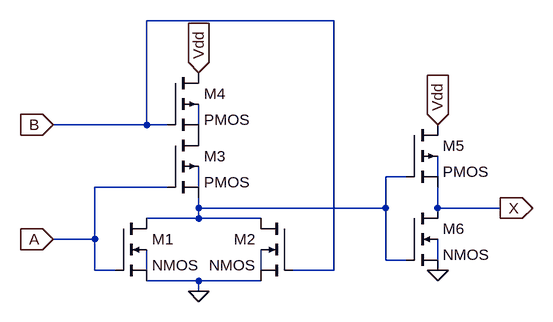
[diagram p0: schematic or_gate.asc]
or_gate.asc, the LTspice schematic file:
Version 4.1
SHEET 1 880 680
WIRE 400 -16 112 -16
WIRE 112 144 112 -16
WIRE 112 144 -32 144
WIRE 144 144 112 144
WIRE 192 144 192 112
WIRE 512 224 480 224
WIRE 560 224 560 192
WIRE 144 240 32 240
WIRE 192 240 192 208
WIRE 192 272 192 256
WIRE 480 272 480 224
WIRE 480 272 192 272
WIRE 560 272 560 240
WIRE 656 272 560 272
WIRE 192 288 192 272
WIRE 192 288 112 288
WIRE 288 288 192 288
WIRE 32 320 32 240
WIRE 32 320 -32 320
WIRE 480 352 480 272
WIRE 512 352 480 352
WIRE 560 352 560 320
WIRE 32 368 32 320
WIRE 64 368 32 368
WIRE 112 368 112 336
WIRE 288 368 288 336
WIRE 400 368 400 -16
WIRE 400 368 336 368
WIRE 192 384 112 384
WIRE 288 384 192 384
WIRE 192 400 192 384
FLAG 192 400 0
FLAG 192 64 Vdd
IOPIN 192 64 In
FLAG -32 320 A
IOPIN -32 320 In
FLAG -32 144 B
IOPIN -32 144 In
FLAG 656 272 X
IOPIN 656 272 Out
FLAG 560 368 0
FLAG 560 144 Vdd
IOPIN 560 144 In
SYMBOL nmos4 64 288 R0
SYMATTR InstName M1
SYMBOL nmos4 336 288 M0
SYMATTR InstName M2
SYMBOL pmos4 144 160 R0
SYMATTR InstName M3
SYMBOL pmos4 144 64 R0
SYMATTR InstName M4
SYMBOL pmos4 512 144 R0
SYMATTR InstName M5
SYMBOL nmos4 512 272 R0
SYMATTR InstName M6

The netlist it stands for:
* or_gate.asc
M1 N002 A 0 N006 NMOS
M2 N002 B 0 N007 NMOS
M3 P001 A N002 N004 PMOS
M4 Vdd B P001 N001 PMOS
M5 Vdd N002 X N003 PMOS
M6 X N002 0 N005 NMOS
.model NMOS NMOS
.model PMOS PMOS
.lib standard.mos
.backanno
.end